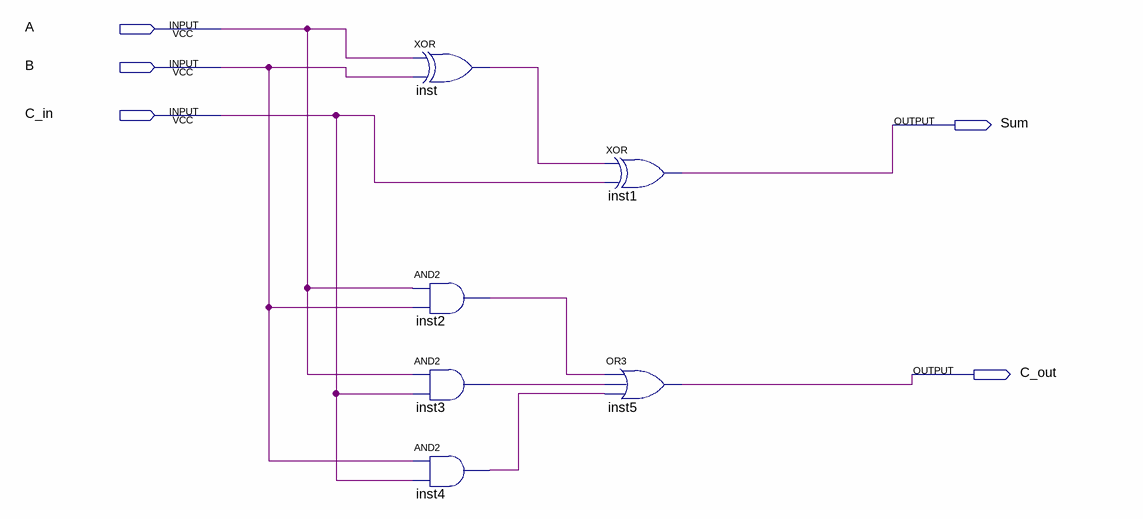
[diagram p0: schematic sheet]
// Quartus schematic lab2_fulladder.bdf as structural Verilog: 6 symbols, 5 pins
module lab2_fulladder (
  input  A,
  input  B,
  input  C_in,
  output Sum,
  output C_out
);

  wire inst2_out, inst3_out, inst4_out, inst_out;

  xor inst (inst_out, A, B);
  and inst2 (inst2_out, A, B);
  and inst3 (inst3_out, A, C_in);
  and inst4 (inst4_out, B, C_in);
  xor inst1 (Sum, inst_out, C_in);
  or inst5 (C_out, inst2_out, inst3_out, inst4_out);
endmodule
